# Altium schematic sheet ODROID.SchDoc
size A4
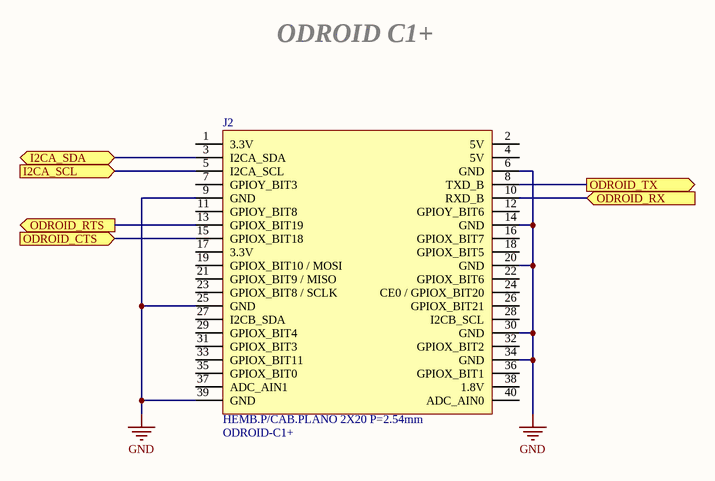
[diagram p0: ODROID.SchDoc]

## Parts
J2  HEMB.P/CAB.PLANO 2X20 P=2.54mm  [ODROID_C1+_MOUNTUP]

## Ports
I2CA_SCL (in), I2CA_SDA (bidir), ODROID_CTS (in), ODROID_RTS (out), ODROID_RX (in), ODROID_TX (out)

## Nets
GND: J2.6(GND) J2.9(GND) J2.14(GND) J2.20(GND) J2.25(GND) J2.30(GND) J2.34(GND) J2.39(GND)
I2CA_SCL: J2.5(I2CA_SCL) ; port I2CA_SCL
I2CA_SDA: J2.3(I2CA_SDA) ; port I2CA_SDA
ODROID_CTS: J2.15(GPIOX_BIT18) ; port ODROID_CTS
ODROID_RTS: J2.13(GPIOX_BIT19) ; port ODROID_RTS
ODROID_RX: J2.10(RXD_B) ; port ODROID_RX
ODROID_TX: J2.8(TXD_B) ; port ODROID_TX

Not connected (* = marked no-connect by the designer): J2 1(3.3V) 2(5V) 4(5V) 7(GPIOY_BIT3) 11(GPIOY_BIT8) 12(GPIOY_BIT6) 16(GPIOX_BIT7) 17(3.3V) 18(GPIOX_BIT5) 19(GPIOX_BIT10_/_MOSI) 21(GPIOX_BIT9_/_MISO) 22(GPIOX_BIT6) 23(GPIOX_BIT8_/_SCLK) 24(CE0_/_GPIOX_BIT20) 26(GPIOX_BIT21) 27(I2CB_SDA) 28(I2CB_SCL) 29(GPIOX_BIT4) 31(GPIOX_BIT3) 32(GPIOX_BIT2) 33(GPIOX_BIT11) 35(GPIOX_BIT0) 36(GPIOX_BIT1) 37(ADC_AIN1) 38(1.8V) 40(ADC_AIN0)

## Notes on the sheet
- ODROID C1+
- (in symbol Odroid_C1+) ODROID-C1+

## Library data of the parts
J2 = Odroid_C1+: Conector para odroid c1+; Cod. Proveedor: CO4751060; Proveedor: Elemon; Encapsulado: Through Hole; Link: http://www.elemon.net